# Altium schematic sheet Alimentation.SchDoc: ClickBoard - Alimentation
size Letter; ApprovedBy: K.C.; Author: Antoine Perron; Organization: Cegep Limoilou; Address1: 1300, 8e Avenue; Address2: Québec, QC; Address3: Canada; Address4: G1J 5L5; Revision: B3; SheetNumber: 2; SheetTotal: 5
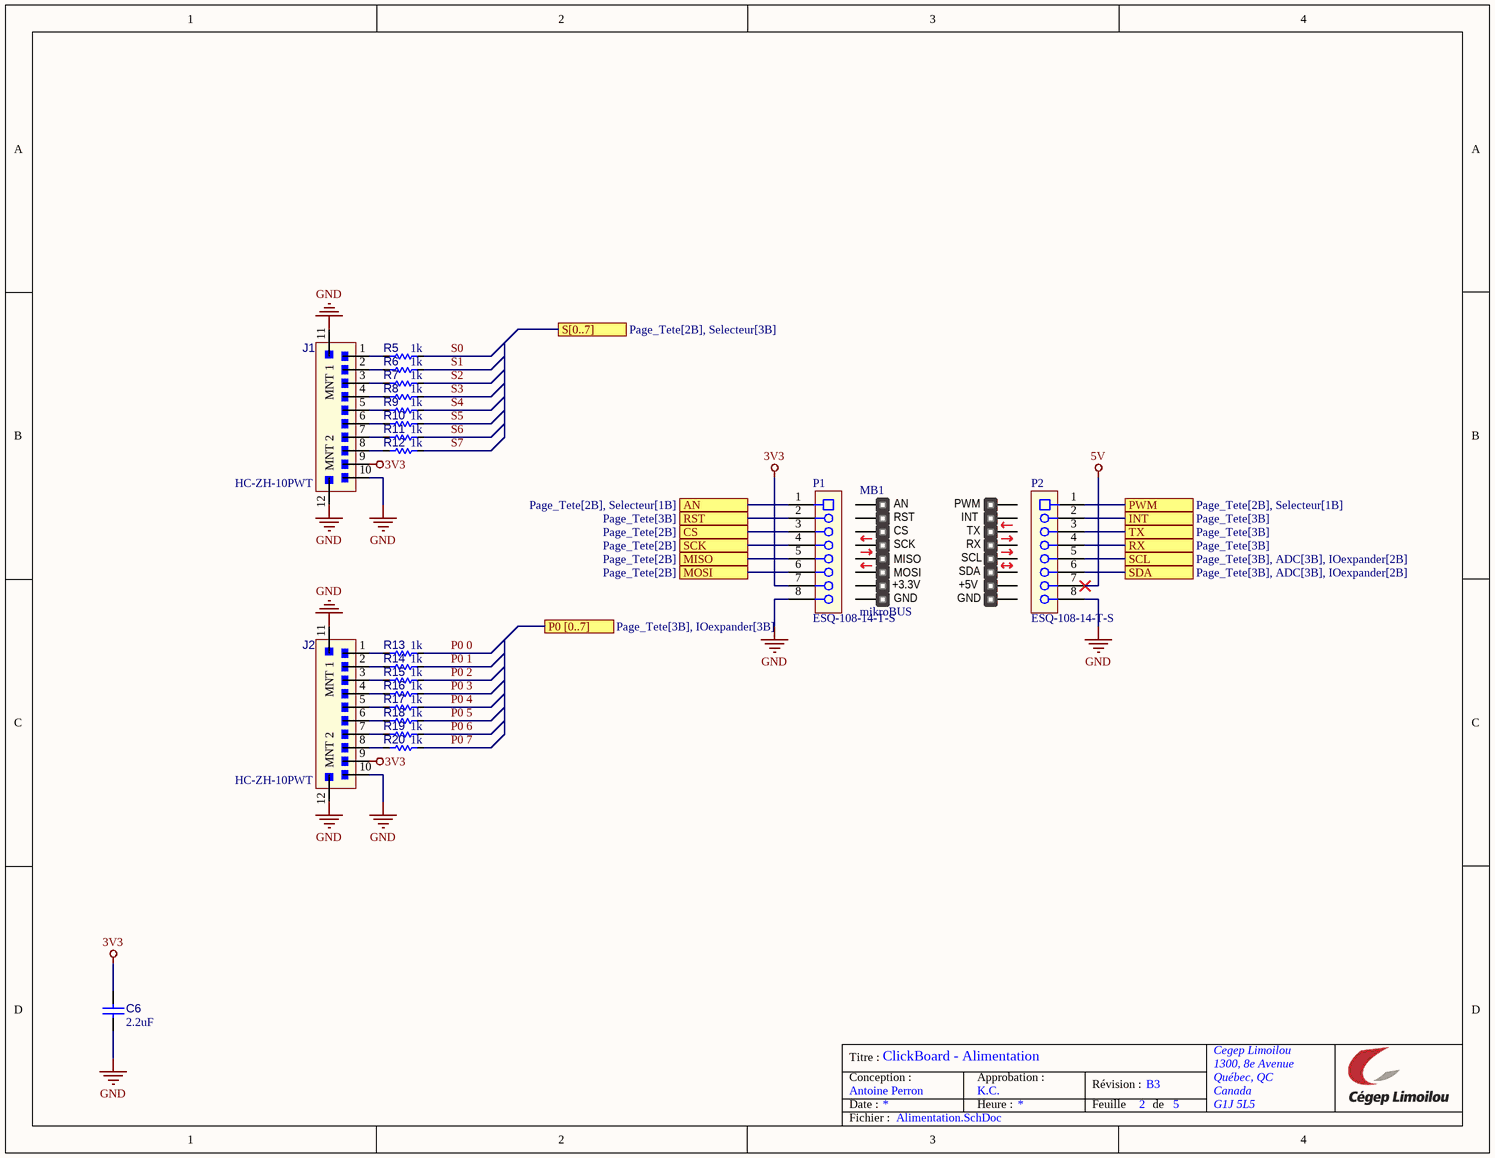
[diagram p0: Alimentation.SchDoc]

## Parts
C6  value 2.2uF  [C_1608[0603]]  (hidden comment: CAP CER 2.2uF 10V X7R 0603)
J1  HC-ZH-10PWT  [J_S10B-ZR-SM4]
J2  HC-ZH-10PWT  [J_S10B-ZR-SM4]
MB1  mikroBUS  [mikroBUS-Large-No-Connector]  (no BOM)
P1  ESQ-108-14-T-S  [CONN_SKT_01X08_100MIL-ELEVATED-LONGPIN]
P2  ESQ-108-14-T-S  [CONN_SKT_01X08_100MIL-ELEVATED-LONGPIN]
R5  value 1k  [R_1608[0603]]  (hidden comment: Res 1k 1% 0603)
R6  value 1k  [R_1608[0603]]  (hidden comment: Res 1k 1% 0603)
R7  value 1k  [R_1608[0603]]  (hidden comment: Res 1k 1% 0603)
R8  value 1k  [R_1608[0603]]  (hidden comment: Res 1k 1% 0603)
R9  value 1k  [R_1608[0603]]  (hidden comment: Res 1k 1% 0603)
R10  value 1k  [R_1608[0603]]  (hidden comment: Res 1k 1% 0603)
R11  value 1k  [R_1608[0603]]  (hidden comment: Res 1k 1% 0603)
R12  value 1k  [R_1608[0603]]  (hidden comment: Res 1k 1% 0603)
R13  value 1k  [R_1608[0603]]  (hidden comment: Res 1k 1% 0603)
R14  value 1k  [R_1608[0603]]  (hidden comment: Res 1k 1% 0603)
R15  value 1k  [R_1608[0603]]  (hidden comment: Res 1k 1% 0603)
R16  value 1k  [R_1608[0603]]  (hidden comment: Res 1k 1% 0603)
R17  value 1k  [R_1608[0603]]  (hidden comment: Res 1k 1% 0603)
R18  value 1k  [R_1608[0603]]  (hidden comment: Res 1k 1% 0603)
R19  value 1k  [R_1608[0603]]  (hidden comment: Res 1k 1% 0603)
R20  value 1k  [R_1608[0603]]  (hidden comment: Res 1k 1% 0603)

## Ports
AN (see Page_Tete[2B], Selecteur[1B]), CS (see Page_Tete[2B]), INT (see Page_Tete[3B]), MISO (see Page_Tete[2B]), MOSI (see Page_Tete[2B]), P0 [0..7] (see Page_Tete[3B], IOexpander[3B]), PWM (see Page_Tete[2B], Selecteur[1B]), RST (see Page_Tete[3B]), RX (see Page_Tete[3B]), S[0..7] (see Page_Tete[2B], Selecteur[3B]), SCK (see Page_Tete[2B]), SCL (see Page_Tete[3B], ADC[3B], IOexpander[2B]), SDA (see Page_Tete[3B], ADC[3B], IOexpander[2B]), TX (see Page_Tete[3B])

## Nets
3V3: C6.2 J1.9 J2.9 P1.7
5V: P2.7
GND: C6.1 J1.10 J1.11(MNT_1) J1.12(MNT_2) J2.10 J2.11(MNT_1) J2.12(MNT_2) P1.8 P2.8
AN: P1.1 ; port AN
CS: P1.3 ; port CS
INT: P2.2 ; port INT
MISO: P1.5 ; port MISO
MOSI: P1.6 ; port MOSI
P0 0: R13.2
P0 1: R14.2
P0 2: R15.2
P0 3: R16.2
P0 4: R17.2
P0 5: R18.2
P0 6: R19.2
P0 7: R20.2
PWM: P2.1 ; port PWM
RST: P1.2 ; port RST
RX: P2.4 ; port RX
S0: R5.2
S1: R6.2
S2: R7.2
S3: R8.2
S4: R9.2
S5: R10.2
S6: R11.2
S7: R12.2
SCK: P1.4 ; port SCK
SCL: P2.5 ; port SCL
SDA: P2.6 ; port SDA
TX: P2.3 ; port TX
NetJ1_1: J1.1 R5.1
NetJ1_2: J1.2 R6.1
NetJ1_3: J1.3 R7.1
NetJ1_4: J1.4 R8.1
NetJ1_5: J1.5 R9.1
NetJ1_6: J1.6 R10.1
NetJ1_7: J1.7 R11.1
NetJ1_8: J1.8 R12.1
NetJ2_1: J2.1 R13.1
NetJ2_2: J2.2 R14.1
NetJ2_3: J2.3 R15.1
NetJ2_4: J2.4 R16.1
NetJ2_5: J2.5 R17.1
NetJ2_6: J2.6 R18.1
NetJ2_7: J2.7 R19.1
NetJ2_8: J2.8 R20.1

Not connected (* = marked no-connect by the designer): MB1 1(AN) 2(RST) 3(CS) 4(SCK) 5(MISO) 6(MOSI) 7(3.3V) 8(GND) 9(GND) 10(5V) 11(SDA) 12(SCL) 13(TX) 14(RX) 15(INT) 16(PWM)

## Notes on the sheet
- Titre :
- Conception :
- Date :
- Approbation :
- Heure :
- Révision :
- Feuille
- de
- Fichier :
- (in symbol mikroBUS compatible add-on board) +3.3V; +5V

## Library data of the parts
C6 = CAP022: Capacitor type 1; Manufacturer 1: Samsung; Manufacturer Part Number 1: CL10B225KP8NNNC; LibRef: CAP022; Tolerance: 10%; Rated Voltage: 10V; Dielectric: X7R; Mounting Technology: SMT; Supplier 1: LCSC; Supplier Part Number 1: C100082
J1 J2 = CONN-1MM5-01X10-S10B-H-SMT: CONN wire to board SMT R/A 10POS 1.5mm; Manufacturer 1: HCTL; Manufacturer Part Number 1: HC-ZH-10PWT; Manufacturer 2: JST; Manufacturer Part Number 2: S10B-ZR-SM4A-TF(LF)(SN); Mounting Technology: SMT; Supplier 1: LCSC; Supplier 2: LCSC; Supplier Part Number 1: C2845432; Supplier Part Number 2: C5149249; Supplier 3: Digikey; Supplier Part Number 3: 455-1700-1-ND
MB1 = mikroBUS compatible add-on board
P1 P2 = CONN-100MIL-SKT-01X08_ELEVATED_LONGPIN: CONN SOCKET 8pos 100mils Elevated; Manufacturer 1: Samtec; Mounting Technology: TH; Manufacturer Part Number 1: ESQ-108-14-T-S; Supplier 1: Digikey; Supplier Part Number 1: SAM9303-ND
R5-R20 = RES015: Resistor type 1; Manufacturer 1: Yageo; Manufacturer Part Number 1: RC0603FR-071KL; LibRef: RES015; Puissance: 1/10W; Max Working Voltage: 75V; Tolerance: 1%; Mounting Technology: SMT; Supplier 1: LCSC; Supplier Part Number 1: C22548